# Altium schematic sheet [08] - DISPLAY.SchDoc
size A3; Organization: Altium Limited; Address1: L3, 12a Rodborough Rd; Address2: Frenchs Forest; Address3: NSW; Address4: Australia 2086; DocumentNumber: 9; SheetNumber: 8; SheetTotal: 10
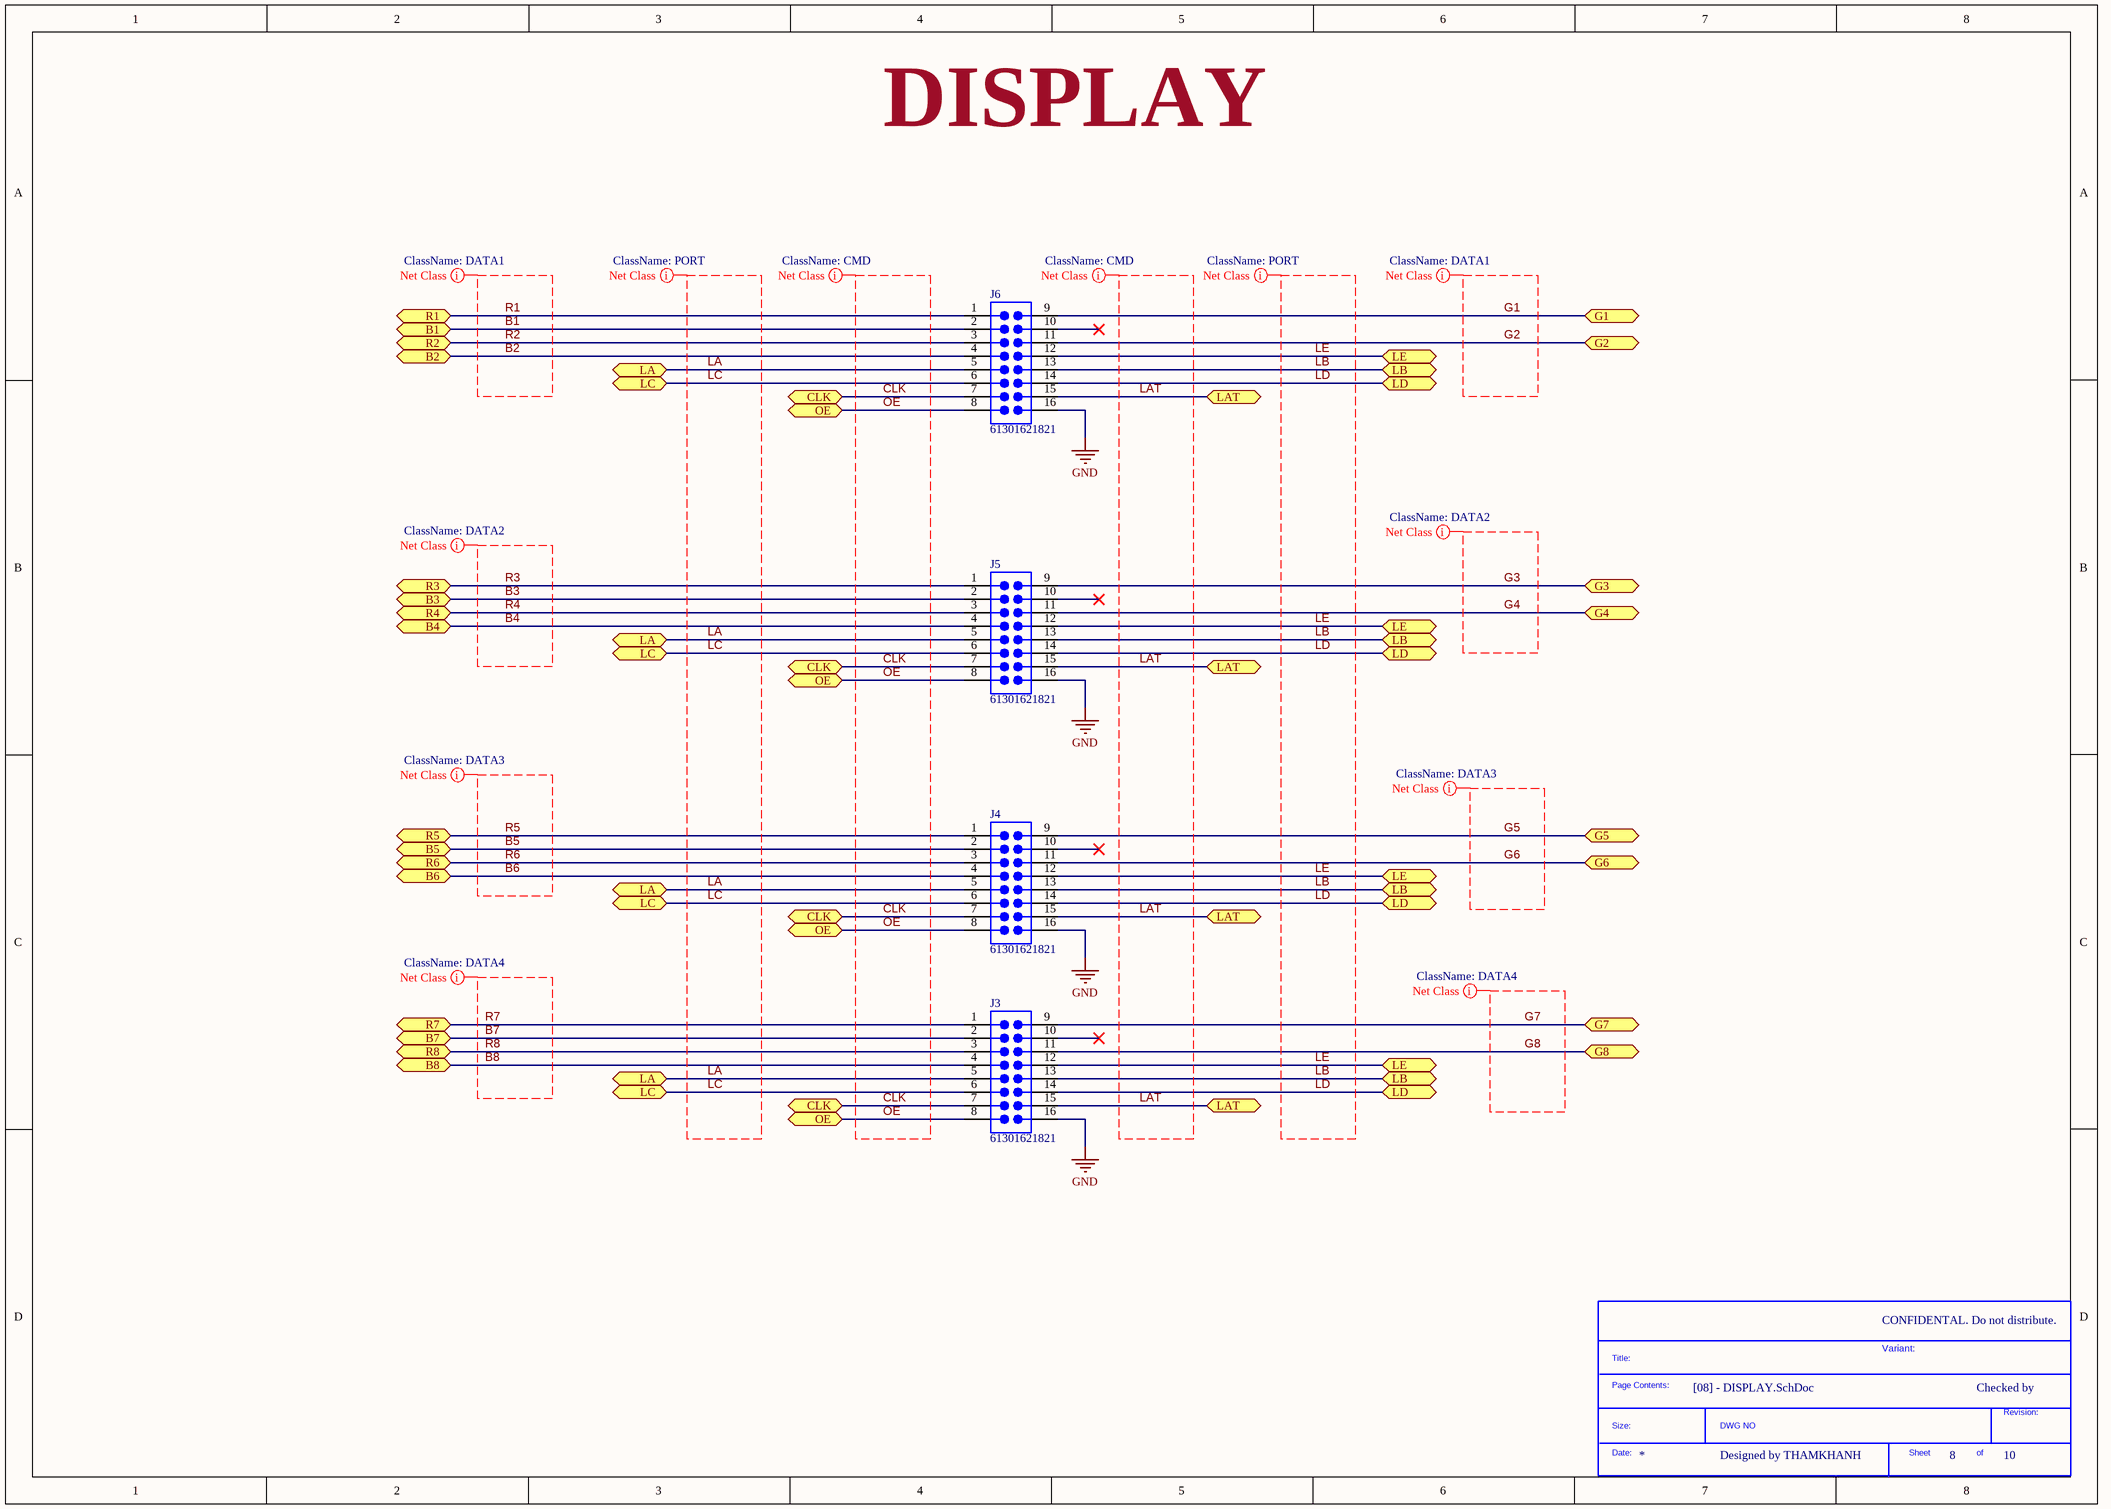
[diagram p0: [08] - DISPLAY.SchDoc]

## Parts
*?  SDTitleBlock  (value not drawn)  (graphical)
J3  61301621821  [61301621821]
J4  61301621821  [61301621821]
J5  61301621821  [61301621821]
J6  61301621821  [61301621821]

## Ports
B1 (bidir), B2 (bidir), B3 (bidir), B4 (bidir), B5 (bidir), B6 (bidir), B7 (bidir), B8 (bidir), CLK (bidir), G1 (bidir), G2 (bidir), G3 (bidir), G4 (bidir), G5 (bidir), G6 (bidir), G7 (bidir), G8 (bidir), LA (bidir), LAT (bidir), LB (bidir), LC (bidir), LD (bidir), LE (bidir), OE (bidir), R1 (bidir), R2 (bidir), R3 (bidir), R4 (bidir), R5 (bidir), R6 (bidir), R7 (bidir), R8 (bidir)

## Nets
GND: J3.16 J4.16 J5.16 J6.16
B1: J6.2 ; port B1
B2: J6.4 ; port B2
B3: J5.2 ; port B3
B4: J5.4 ; port B4
B5: J4.2 ; port B5
B6: J4.4 ; port B6
B7: J3.2 ; port B7
B8: J3.4 ; port B8
CLK: J3.7 J4.7 J5.7 J6.7 ; port CLK
G1: J6.9 ; port G1
G2: J6.11 ; port G2
G3: J5.9 ; port G3
G4: J5.11 ; port G4
G5: J4.9 ; port G5
G6: J4.11 ; port G6
G7: J3.9 ; port G7
G8: J3.11 ; port G8
LA: J3.5 J4.5 J5.5 J6.5 ; port LA
LAT: J3.15 J4.15 J5.15 J6.15 ; port LAT
LB: J3.13 J4.13 J5.13 J6.13 ; port LB
LC: J3.6 J4.6 J5.6 J6.6 ; port LC
LD: J3.14 J4.14 J5.14 J6.14 ; port LD
LE: J3.12 J4.12 J5.12 J6.12 ; port LE
OE: J3.8 J4.8 J5.8 J6.8 ; port OE
R1: J6.1 ; port R1
R2: J6.3 ; port R2
R3: J5.1 ; port R3
R4: J5.3 ; port R4
R5: J4.1 ; port R5
R6: J4.3 ; port R6
R7: J3.1 ; port R7
R8: J3.3 ; port R8

Not connected (* = marked no-connect by the designer): J3 10*; J4 10*; J5 10*; J6 10*

## Layout directives
net class CMD: CLK, LAT, OE
net class DATA1: B1, B2, G1, G2, R1, R2
net class PORT: LA, LB, LC, LD, LE
net class DATA2: B3, B4, G3, G4, R3, R4
net class DATA3: B5, B6, G5, G6, R5, R6
net class DATA4: B7, B8, G7, G8, R7, R8

## Notes on the sheet
- DISPLAY
- CONFIDENTAL. Do not distribute.
- Variant:
- Checked by
- Designed by THAMKHANH
- Title
- Size:
- Date:
- A3
- Number:
- Time:
- Revision:
- Sheet
- of
- File:
- (in symbol SDTitleBlock) Title:; Page Contents:; Revision:; Size:; DWG NO; Date:; Sheet; of

## Library data of the parts
J3-J6 = JP8 2.54MM Dual Socket: 2.54 mm Dual Socket Header, 16p; PublishedDate: July 2016; Publisher: Wurth Elektronik; ComponentLink1Description: Manufacturer; ComponentLink1URL: http://www.we-online.de; ComponentLink2Description: Datasheet; ComponentLink2URL: http://katalog.we-online.de/em/datasheet/6130xx21821.pdf; PartNumber: 61301621821; PinNumber: 16p